# EAGLE design audio-player-16bit (EAGLE 6.3)
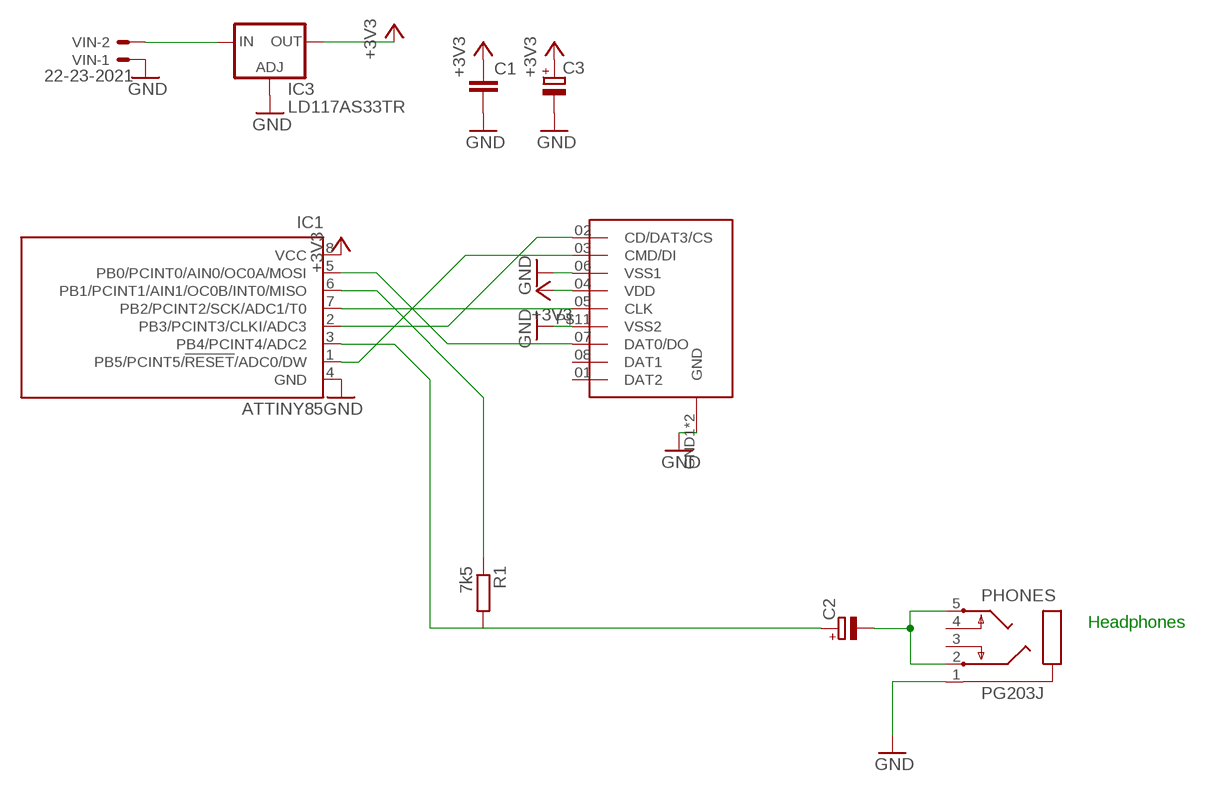
[diagram p0: schematic, sheet 1]

## Parts
C1  C-EUC1206  [C1206]
C2  CPOL-EU140CLH-1014  [140CLH-1014]
C3  CPOL-EUCT3528  [CT3528]
IC1  ATTINY85  TINY13-20PU  [DIL08]
IC3  LD117AS33TR  [SOT223]
PHONES  PG203J  [PG203J]
R1  7k5  R-EU_R1206  [R1206]
U$1  MICROSD  [SCHD3A0100]
VIN  22-23-2021  [22-23-2021]

## Nets
+3V3: C1.1 C3.+ IC1.8(VCC) IC3.4(OUT) U$1.04(VDD)
GND: C1.2 C3.- IC1.4(GND) IC3.1(ADJ) PHONES.1 U$1.06(VSS1) U$1.GND1(GND) U$1.GND2(GND) U$1.P$11(VSS2) VIN.1
N$1: IC1.2(PB3/PCINT3/CLKI/ADC3) U$1.02(CD/DAT3/CS)
N$2: IC1.6(PB1/PCINT1/AIN1/OC0B/INT0/MISO) R1.1
N$3: IC1.7(PB2/PCINT2/SCK/ADC1/T0) U$1.05(CLK)
N$5: C2.+ IC1.3(PB4/PCINT4/ADC2) R1.2
N$7: IC1.1(PB5/PCINT5/!RESET!/ADC0/DW) U$1.03(CMD/DI)
N$8: IC1.5(PB0/PCINT0/AIN0/OC0A/MOSI) U$1.07(DAT0/DO)
N$9: IC3.3(IN) VIN.2
N$14: C2.- PHONES.2 PHONES.5
Unconnected: PHONES.3 PHONES.4 U$1.01(DAT2) U$1.08(DAT1)

## Notes on the sheet
- Headphones

## Library data of the parts
C1 = rcl:C-EU: CAPACITOR, European symbol
C2 C3 = rcl:CPOL-EU: POLARIZED CAPACITOR, European symbol
IC1 = atmel:TINY13: 8-bit AVR Microcontroller with 1K Bytes In-System Programmable Flash Source: http://www.atmel.com/dyn/resources/prod_documents/2535S.pdf; MPN: ATTINY13-20PU; OC_FARNELL: 9171550; OC_NEWARK: 96K6521
IC3 = v-reg:LD117A?*: Low drop fixed and adjustable positive voltage regulators 1 A Source: http://www.st.com/stonline/products/literature/ds/7194/ld1117axx.pdf
PHONES = con-hirschmann:PG203J: MIC/HEADPHONE JACK KS-S stereo microphone/headphone jack PG203JN (Schukat)
R1 = rcl:R-EU_: RESISTOR, European symbol
U$1 = anyma-lib:MICROSD
VIN = con-molex:22-23-2021: .100" (2.54mm) Center Header - 2 Pin; MF: MOLEX; MPN: 22-23-2021; OC_FARNELL: 1462926; OC_NEWARK: 25C3832

## Board
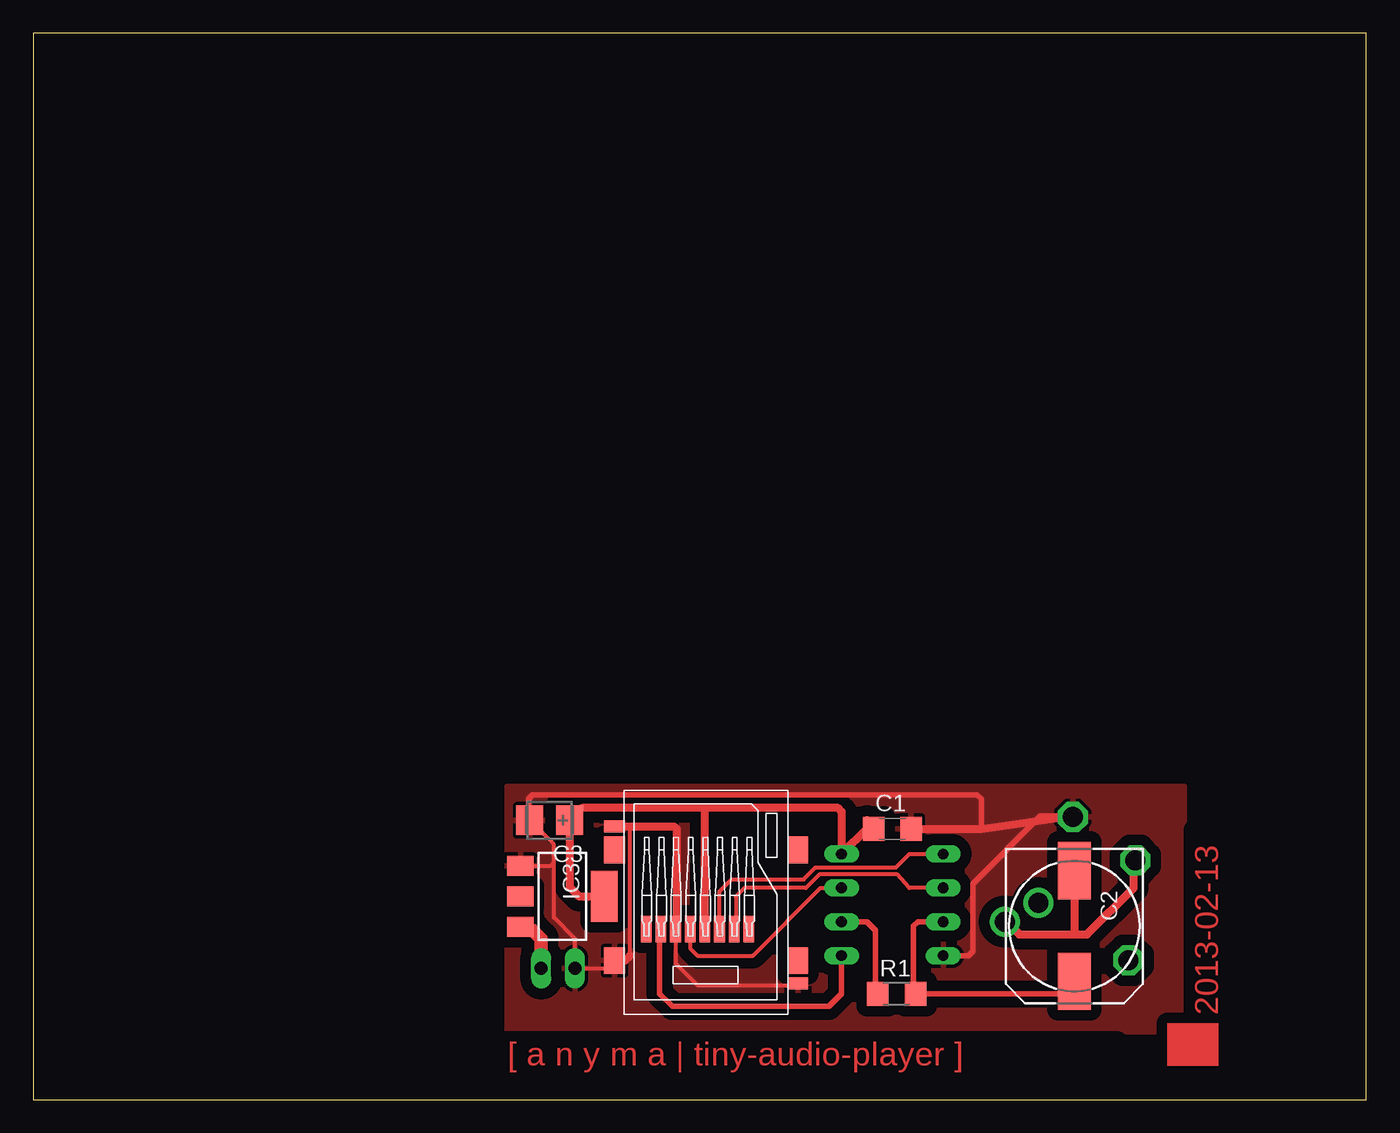
[diagram p1: board, top side]
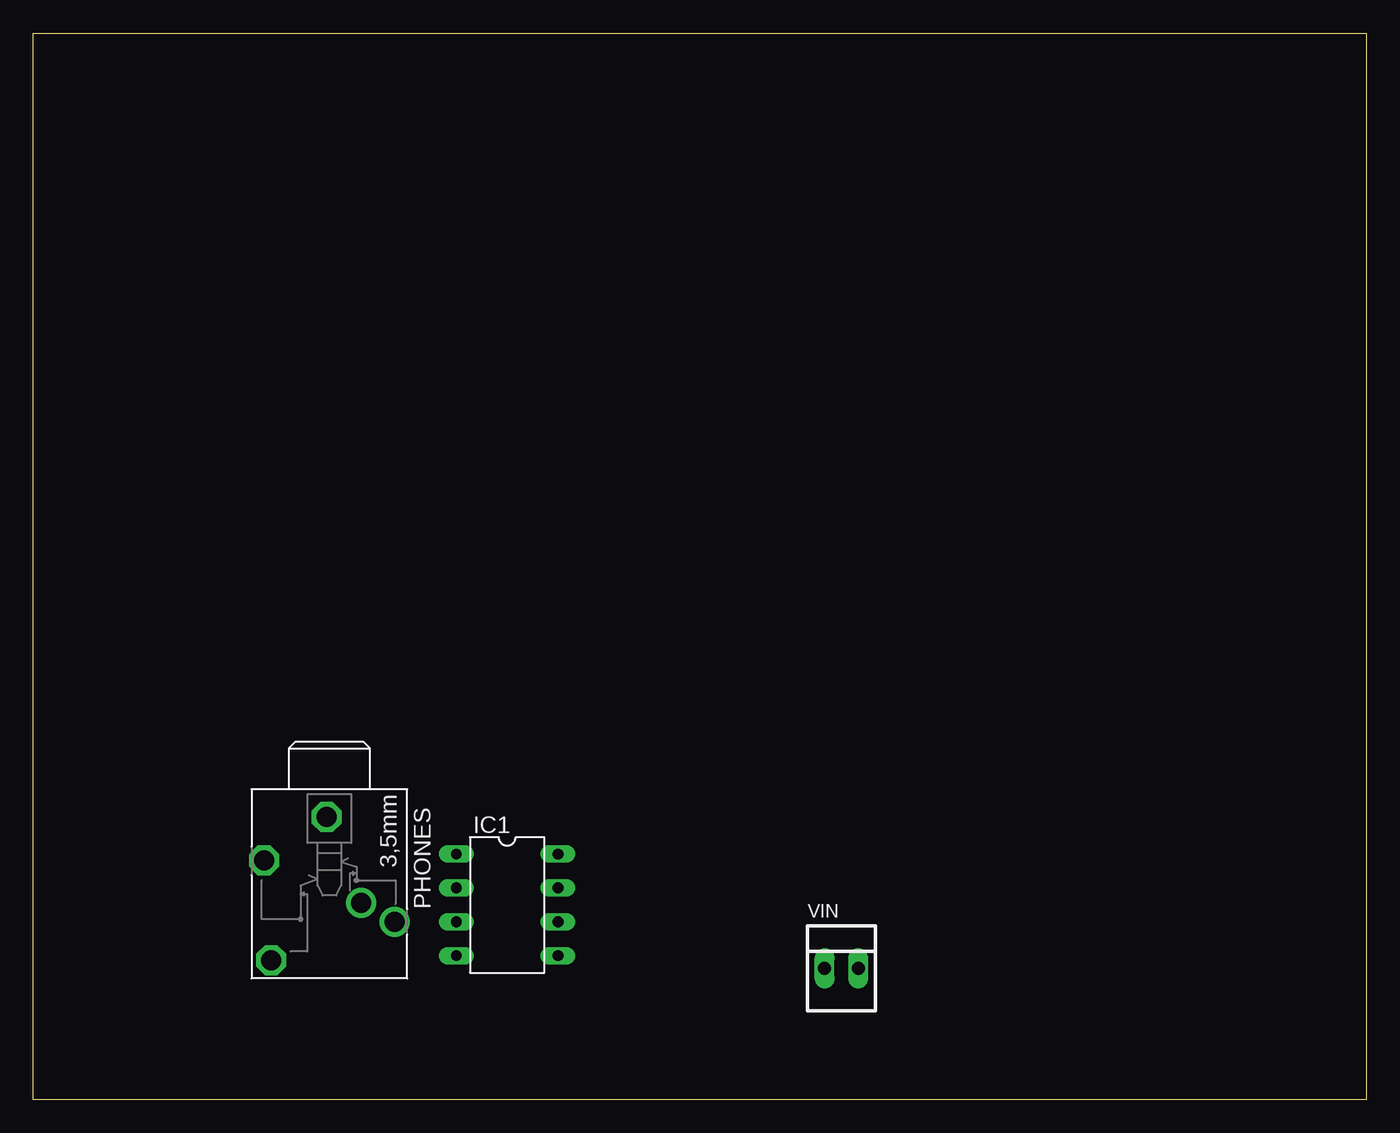
[diagram p2: board, bottom side, seen from below]

Size 100 x 80 mm. Coordinates in mm from the lower left corner, seen from the top.
Outline: 0,0 100,0 100,80 0,80 0,0
Copper layers (1*16): Top 0.035mm / dielectric 1.5mm / Bottom 0.035mm
Design rules "default": minimum track width 10mil, minimum drill 24mil, track to track 8mil, track to pad 8mil, pad to pad 8mil, via to via 8mil, smd to smd 8mil, copper to edge 40mil, drill to drill 8mil, minimum pad ring 10mil, minimum via ring 8mil, stop-mask expansion 4mil, vias tented up to drill 0mil, thermal gap 10mil
tRestrict: area 45.7,14 to 47.6,20.3

### Footprints (pad centres in the part's own frame; a part is rotated, then mirrored left to right if it is on the bottom)
C1206 = smd 1.6 x 1.8: 1 -1.4,0; 2 1.4,0
140CLH-1014 = smd 4.3 x 2.5: + 4.15,0; - -4.15,0
CT3528 = smd 2 x 2.2: + -1.5,0; - 1.5,0
DIL08 = drill 0.813 long: 1 -3.81,-3.81; 2 -1.27,-3.81; 3 1.27,-3.81; 4 3.81,-3.81; 5 3.81,3.81; 6 1.27,3.81; 7 -1.27,3.81; 8 -3.81,3.81
SOT223 = smd 1.5 x 2: 1 -2.3,-3.15; 2 0,-3.15; 3 2.3,-3.15 | smd 3.8 x 2: 4 0,3.15
PG203J = drill 1.499 octagon: 1 -5.004,-0.203; 4 5.74,-4.369; 5 -1.753,-4.902 | drill 1.499: 2 2.845,4.902; 3 1.448,2.388
R1206 = smd 1.6 x 1.803: 1 -1.422,0; 2 1.422,0
SCHD3A0100 = smd 0.8 x 2: 01 3.2,-10.4; 02 2.1,-10.4; 03 1,-10.4; 04 -0.1,-10.4; 05 -1.2,-10.4; 06 -2.3,-10.4; 07 -3.4,-10.4; 08 -4.5,-10.4 | smd 1.55 x 0.9: GND1 -6.875,-2.7; GND2 6.875,-14.45 | smd 1.55 x 2: P$11 -6.875,-12.75; P$12 6.875,-12.75; P$13 6.875,-4.45; P$14 -6.875,-4.45
22-23-2021 = drill 1 long: 1 -1.27,0; 2 1.27,0

### Placement (x,y rotation side)
C1  64.45,20.32 0 top
C2  78.11,13.02 270 top
C3  38.73,20.95 180 top
IC1  64.45,14.61 270 bottom
IC3  39.69,15.24 270 top
PHONES  77.79,16.19 270 bottom
R1  64.77,7.94 0 top
U$1  50.48,23.18 0 top
VIN  39.37,9.84 0 bottom

### Tracks (layer width: path | path; a pad name or v marks a point on that pad's centre or on a via)
+3V3
  Top 0.61: U$1.04 50.38,21.69 50.16,21.91 | 50.16,21.91 41.27,21.91 40.23,21.5 C3.+ 40.23,15.96 40.96,15.24 IC3.4 | 50.16,21.91 60.33,21.91 60.64,21.59 IC1.8 62.55,20.32 62.55,20.95 63.05,20.45 C1.1
GND
  Top 0.305: U$1.06 48.18,10.24 49.85,8.57 57.2,8.57 U$1.GND2 | 39.05,17.78 39.05,13.65 40.64,12.06 VIN.1 43.02,9.84 U$1.P$11 | 39.05,17.78 39.05,19.14 C3.- | IC3.1 38.81,17.54 39.05,17.78 | 44.77,10.79 44.77,20.48
  Top 0.406: IC1.4 70.17,10.79 70.48,11.11 70.48,16.19 75.56,21.27 77.92,21.27 | 71.12,20.32 71.12,22.54 70.8,22.86 37.47,22.86 37.15,22.54 37.15,21.04 C3.-
  Top 0.61: C1.2 71.12,20.32 77.92,21.27 PHONES.1 | U$1.GND1 44.77,20.48 48.1,20.48 48.26,20.32 48.26,12.86 U$1.06 | U$1.P$11 44.4,10.43 44.77,10.79
  pour Top (isolate 0.813): 35.56,5.08 86.36,5.08 86.36,23.5 35.56,23.5
N$1
  Top 0.305: IC1.2 65.72,15.88 64.83,16.88 58.98,16.88 57.96,15.88 53.34,15.88 52.7,15.24 52.7,12.9 U$1.02
N$2
  Top 0.406: IC1.6 62.55,13.34 63.18,12.7 63.18,8.1 R1.1
N$3
  Top 0.305: U$1.05 49.28,11.36 49.85,10.79 53.98,10.79 59.05,15.88 IC1.7
N$5
  Top 0.406: C2.+ 78.08,8.89 78.42,8.26 78.42,7.94 R1.2 66.04,8.09 66.04,13.02 66.36,13.34 IC1.3
N$7
  Top 0.305: U$1.03 51.48,15.61 52.39,16.51 57.78,16.51 58.67,17.4 64.7,17.4 65.72,18.41 IC1.1
N$8
  Top 0.406: U$1.07 46.99,12.78 46.99,7.94 47.94,6.99 59.69,6.99 60.64,7.94 IC1.5
N$9
  Top 1.016: VIN.2 38.1,12.06 37.47,12.7 36.78,12.7 IC3.3
N$14
  Top 0.61: PHONES.2 73.01,13.35 73.98,12.38 78.11,12.38 | 78.11,12.38 79.06,12.38 82.55,15.88 82.55,17.8 PHONES.5 | C2.- 78.11,12.38
(copper drawn outside any net)
  shapes: Top area x1

### Text on the board
Top: 2013-02-13 | [ a n y m a | tiny-audio-player ]